# Altium project 树莓派用.PrjPcb
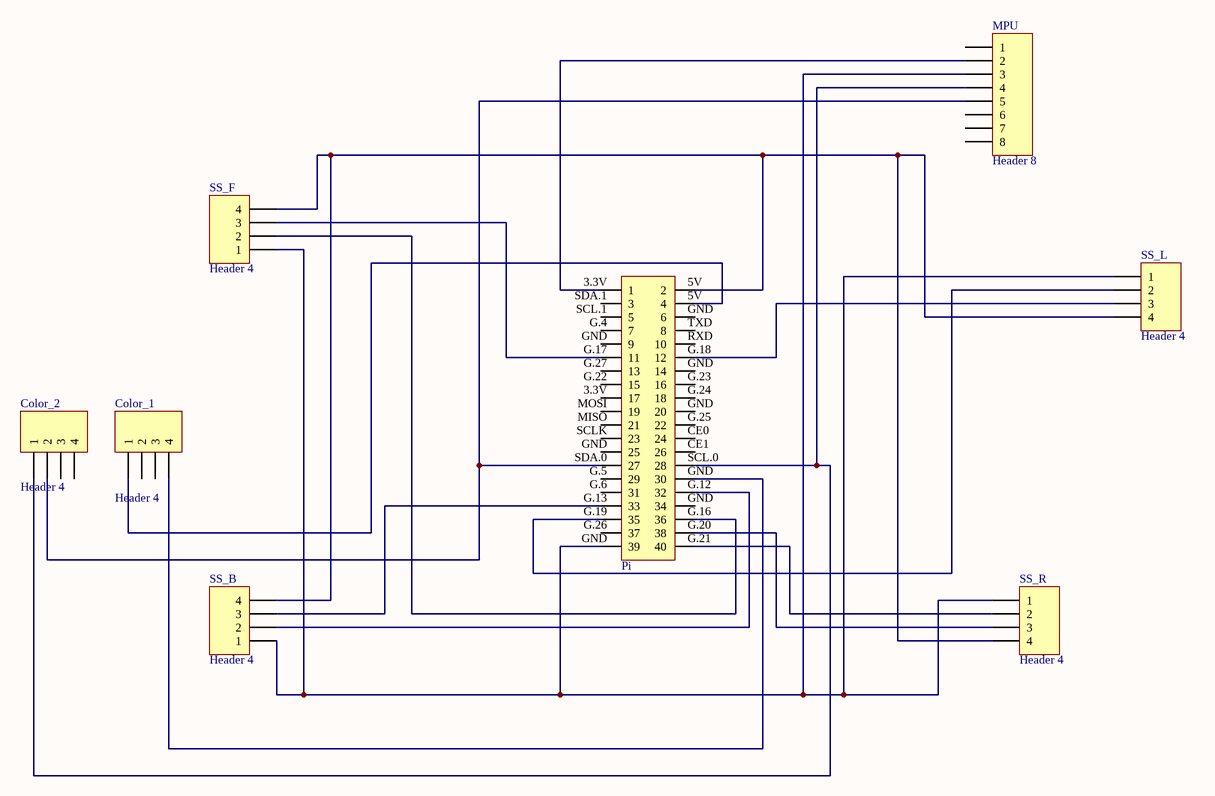
[diagram p0: 树莓派用.SchDoc]
1 sheet, 8 parts. Net scope: global (net labels, ports and power ports of the same name join across sheets).
Board file: 树莓派用.PcbDoc

## Sheet 树莓派用.SchDoc
size A4

### Parts
Color_1  Header 4  [HDR1X4]
Color_2  Header 4  [HDR1X4]
MPU  Header 8  [HDR1X8]
Pi  Header 2X11  [IDC2.54-LI-2x20P]  (value not drawn)
SS_B  Header 4  [HDR1X4]
SS_F  Header 4  [HDR1X4]
SS_L  Header 4  [HDR1X4]
SS_R  Header 4  [HDR1X4]

### Nets
NetColor_1_GND: Color_1.GND(4) Pi.GND(6)
NetColor_1_VCC: Color_1.VCC(1) Pi.5V(4)
NetColor_2_SCL: Color_2.SCL(1) MPU.SCL(4) Pi.SCL.0(28)
NetColor_2_SDA: Color_2.SDA(2) MPU.SDA(5) Pi.SDA.0(27)
NetMPU_3V3: MPU.3V3(2) Pi.3.3V(1)
NetMPU_GND: MPU.GND(3) Pi.GND(39) SS_B.Gnd(1) SS_F.Gnd(1) SS_L.Gnd(1) SS_R.Gnd(1)
NetPi_5V: Pi.5V(2) SS_B.Vcc(4) SS_F.Vcc(4) SS_L.Vcc(4) SS_R.Vcc(4)
NetPi_G.12: Pi.G.12(32) SS_B.Echo(2)
NetPi_G.13: Pi.G.13(33) SS_B.Trig(3)
NetPi_G.16: Pi.G.16(36) SS_F.Echo(2)
NetPi_G.17: Pi.G.17(11) SS_F.Trig(3)
NetPi_G.18: Pi.G.18(12) SS_L.Trig(3)
NetPi_G.19: Pi.G.19(35) SS_L.Echo(2)
NetPi_G.20: Pi.G.20(38) SS_R.Trig(3)
NetPi_G.21: Pi.G.21(40) SS_R.Echo(2)

Not connected (* = marked no-connect by the designer): Color_1 CT(2) DR(3); Color_2 INT(3) NC(4); MPU A_INTI(7) DRDY(8) M_DRDY(6) VCC_IN(1); Pi CE0(24) CE1(26) G.4(7) G.5(29) G.6(31) G.22(15) G.23(16) G.24(18) G.25(22) G.26(37) G.27(13) MISO(21) MOSI(19) RXD(10) SCL.1(5) SCLK(23) SDA.1(3) TXD(8)

### Library data of the parts
Color_1 Color_2 SS_B SS_F SS_L SS_R = Header 4: Header, 4-Pin; LatestRevisionDate: 17-Jul-2002; LatestRevisionNote: Re-released for DXP Platform.; Publisher: Altium Limited
MPU = Header 8: Header, 8-Pin; LatestRevisionDate: 17-Jul-2002; LatestRevisionNote: Re-released for DXP Platform.; Publisher: Altium Limited
Pi = Header 20X2: 20*2P接插件; 版权归属: 封装库来自淘宝 ID：黄晶宝石; 优秀评价可免费更新: 联系淘宝ID：黄晶宝石，获取更新版封装库; 卖家免费技术支持，联系售后: 唯一出售店铺网址https://shop463601444.taobao.com; BOM名称: 20*2P接插件